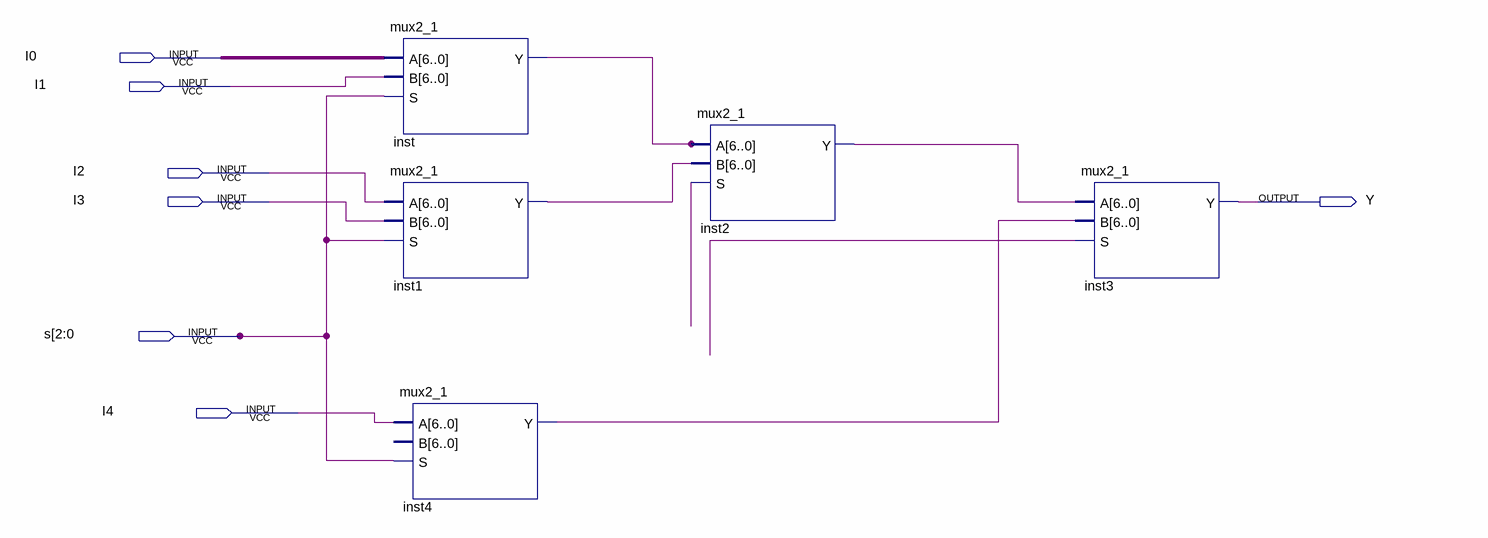
[diagram p0: schematic sheet]
// Quartus schematic 5-1MUX.bdf as structural Verilog: 5 symbols, 7 pins
module \5-1MUX  (
  input  I0,
  input  I1,
  input  I2,
  input  I3,
  input  \s[2:0 ,
  input  I4,
  output Y
);

  wire inst1_y, inst2_y, inst4_y, inst_y, undriven_2, undriven_3;
  wire [6:0] undriven;

  mux2_1 inst (.A(undriven), .B({7{I1}}), .S(\s[2:0 ), .Y(inst_y));
  mux2_1 inst1 (.A({7{I2}}), .B({7{I3}}), .S(\s[2:0 ), .Y(inst1_y));
  mux2_1 inst4 (.A({7{I4}}), .S(\s[2:0 ), .Y(inst4_y));  // open: B
  mux2_1 inst2 (.A({7{inst_y}}), .B({7{inst1_y}}), .S(undriven_2), .Y(inst2_y));
  mux2_1 inst3 (.A({7{inst2_y}}), .B({7{inst4_y}}), .S(undriven_3), .Y(Y));
endmodule
